# Altium project LCD.PrjPcb
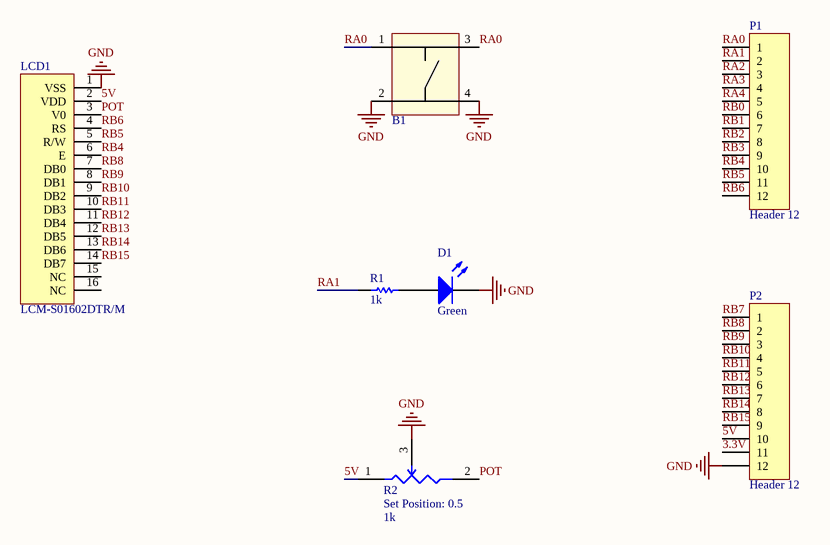
[diagram p0: Schema.SchDoc]
1 sheet, 7 parts. Net scope: global (net labels, ports and power ports of the same name join across sheets).
Board file: PCB.PcbDoc

## Sheet Schema.SchDoc
size A

### Parts
B1  BoutonPoussoir  [BoutonPoussoirMini]  (value not drawn)
D1  Color: Green  [LED_GREEN]  (hidden comment: LED_GREEN)
LCD1  LCM-S01602DTR/M  [LCM-S01602DTR/M]
P1  Header 12  [HDR1X12]
P2  Header 12  [HDR1X12]
R1  value 1k  [RES1206R]  (hidden comment: Res)
R2  value 1k  Set Position: 0.5  [Potentiometer]  (hidden comment: ResVar)

### Nets
GND: B1.2 B1.4 D1.2(K) LCD1.1(VSS) P2.12 R2.3(Wiper)
3.3V: P2.11
5V: LCD1.2(VDD) P2.10 R2.1(CCW)
POT: LCD1.3(V0) R2.2(CW)
RA0: B1.1 B1.3 P1.1
RA1: P1.2 R1.1
RA2: P1.3
RA3: P1.4
RA4: P1.5
RB0: P1.6
RB1: P1.7
RB2: P1.8
RB3: P1.9
RB4: LCD1.6(E) P1.10
RB5: LCD1.5(R/W) P1.11
RB6: LCD1.4(RS) P1.12
RB7: P2.1
RB8: LCD1.7(DB0) P2.2
RB9: LCD1.8(DB1) P2.3
RB10: LCD1.9(DB2) P2.4
RB11: LCD1.10(DB3) P2.5
RB12: LCD1.11(DB4) P2.6
RB13: LCD1.12(DB5) P2.7
RB14: LCD1.13(DB6) P2.8
RB15: LCD1.14(DB7) P2.9
NetD1_1: D1.1(A) R1.2

Not connected (* = marked no-connect by the designer): LCD1 15(NC) 16(NC)

### Library data of the parts
B1 = BoutonPoussoir: Switch Tactile SPST-NO; Supplier 1: Digi-Key; Supplier Part Number 1: SW422-ND
D1 = LED_GREEN: Typical Green LED; Published: 8-Jun-2000; LatestRevisionDate: 08-Jul-2005; LatestRevisionNote: Mech Layer 1 removed.; PackageReference: LED-0; Publisher: Altium Limited; PackageDescription: LED; 2 Leads; Supplier 1: Digi-Key; Supplier Part Number 1: 160-1852-ND
LCD1 = LCM-S01602DTR/M: LCD MODULE 16X2 CHARACTER; LatestRevisionDate: 17-Jul-2002; LatestRevisionNote: Re-released for DXP Platform.; Publisher: Altium Limited; Supplier 1: Digi-Key
P1 P2 = Header 12: Header, 12-Pin; LatestRevisionDate: 17-Jul-2002; LatestRevisionNote: Re-released for DXP Platform.; Publisher: Altium Limited
R1 = Res: Resistor; Published: 8-Jun-2000; LatestRevisionDate: 17-Jul-2002; LatestRevisionNote: Re-released for DXP Platform.; PackageReference: AXIAL-0.3; Publisher: Altium Limited; PackageDescription: Axial Device, Thru-Hole; 2 Leads; 0.3 in Pin Spacing
R2 = ResVar: Potentiometer; Sim Note: Enter the Resistance value and the set point into parameter fields.; Published: 24-Mar-1999; LatestRevisionDate: 17-Jul-2002; LatestRevisionNote: Re-released for DXP Platform.; PackageReference: VR3; Publisher: Altium Limited; PackageDescription: Variable Resistor, Thru-Hole; 3 Leads; Supplier 1: Digi-Key; Supplier Part Number 1: 3386P-102LF-ND